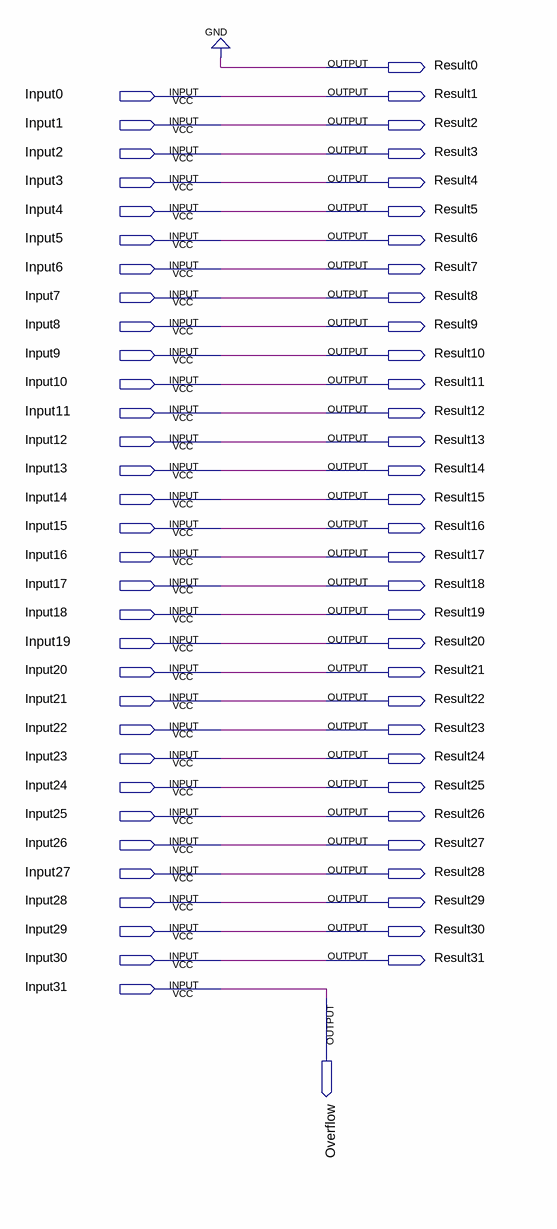
[diagram p0: schematic sheet]
// Quartus schematic shift1left32bit.bdf as structural Verilog: 0 symbols, 65 pins
module shift1left32bit (
  input  Input0,
  input  Input1,
  input  Input2,
  input  Input3,
  input  Input4,
  input  Input5,
  input  Input6,
  input  Input7,
  input  Input8,
  input  Input9,
  input  Input10,
  input  Input11,
  input  Input12,
  input  Input13,
  input  Input14,
  input  Input15,
  input  Input16,
  input  Input17,
  input  Input18,
  input  Input19,
  input  Input20,
  input  Input21,
  input  Input22,
  input  Input23,
  input  Input24,
  input  Input25,
  input  Input26,
  input  Input27,
  input  Input28,
  input  Input29,
  input  Input30,
  input  Input31,
  output Result0,
  output Result1,
  output Result2,
  output Result3,
  output Result4,
  output Result5,
  output Result6,
  output Result7,
  output Result8,
  output Result9,
  output Result10,
  output Result11,
  output Result12,
  output Result13,
  output Result14,
  output Result15,
  output Result16,
  output Result17,
  output Result18,
  output Result19,
  output Result20,
  output Result21,
  output Result22,
  output Result23,
  output Result24,
  output Result25,
  output Result26,
  output Result27,
  output Result28,
  output Result29,
  output Result30,
  output Result31,
  output Overflow
);


  assign Overflow = Input31;
  assign Result0 = 1'b0;
  assign Result1 = Input0;
  assign Result2 = Input1;
  assign Result3 = Input2;
  assign Result4 = Input3;
  assign Result5 = Input4;
  assign Result6 = Input5;
  assign Result7 = Input6;
  assign Result8 = Input7;
  assign Result9 = Input8;
  assign Result10 = Input9;
  assign Result11 = Input10;
  assign Result12 = Input11;
  assign Result13 = Input12;
  assign Result14 = Input13;
  assign Result15 = Input14;
  assign Result16 = Input15;
  assign Result17 = Input16;
  assign Result18 = Input17;
  assign Result19 = Input18;
  assign Result20 = Input19;
  assign Result21 = Input20;
  assign Result22 = Input21;
  assign Result23 = Input22;
  assign Result24 = Input23;
  assign Result25 = Input24;
  assign Result26 = Input25;
  assign Result27 = Input26;
  assign Result28 = Input27;
  assign Result29 = Input28;
  assign Result30 = Input29;
  assign Result31 = Input30;
endmodule
